# EAGLE design RGBClock (EAGLE 6.5.0)
AUTHOR_NAME: Matthias Beckert
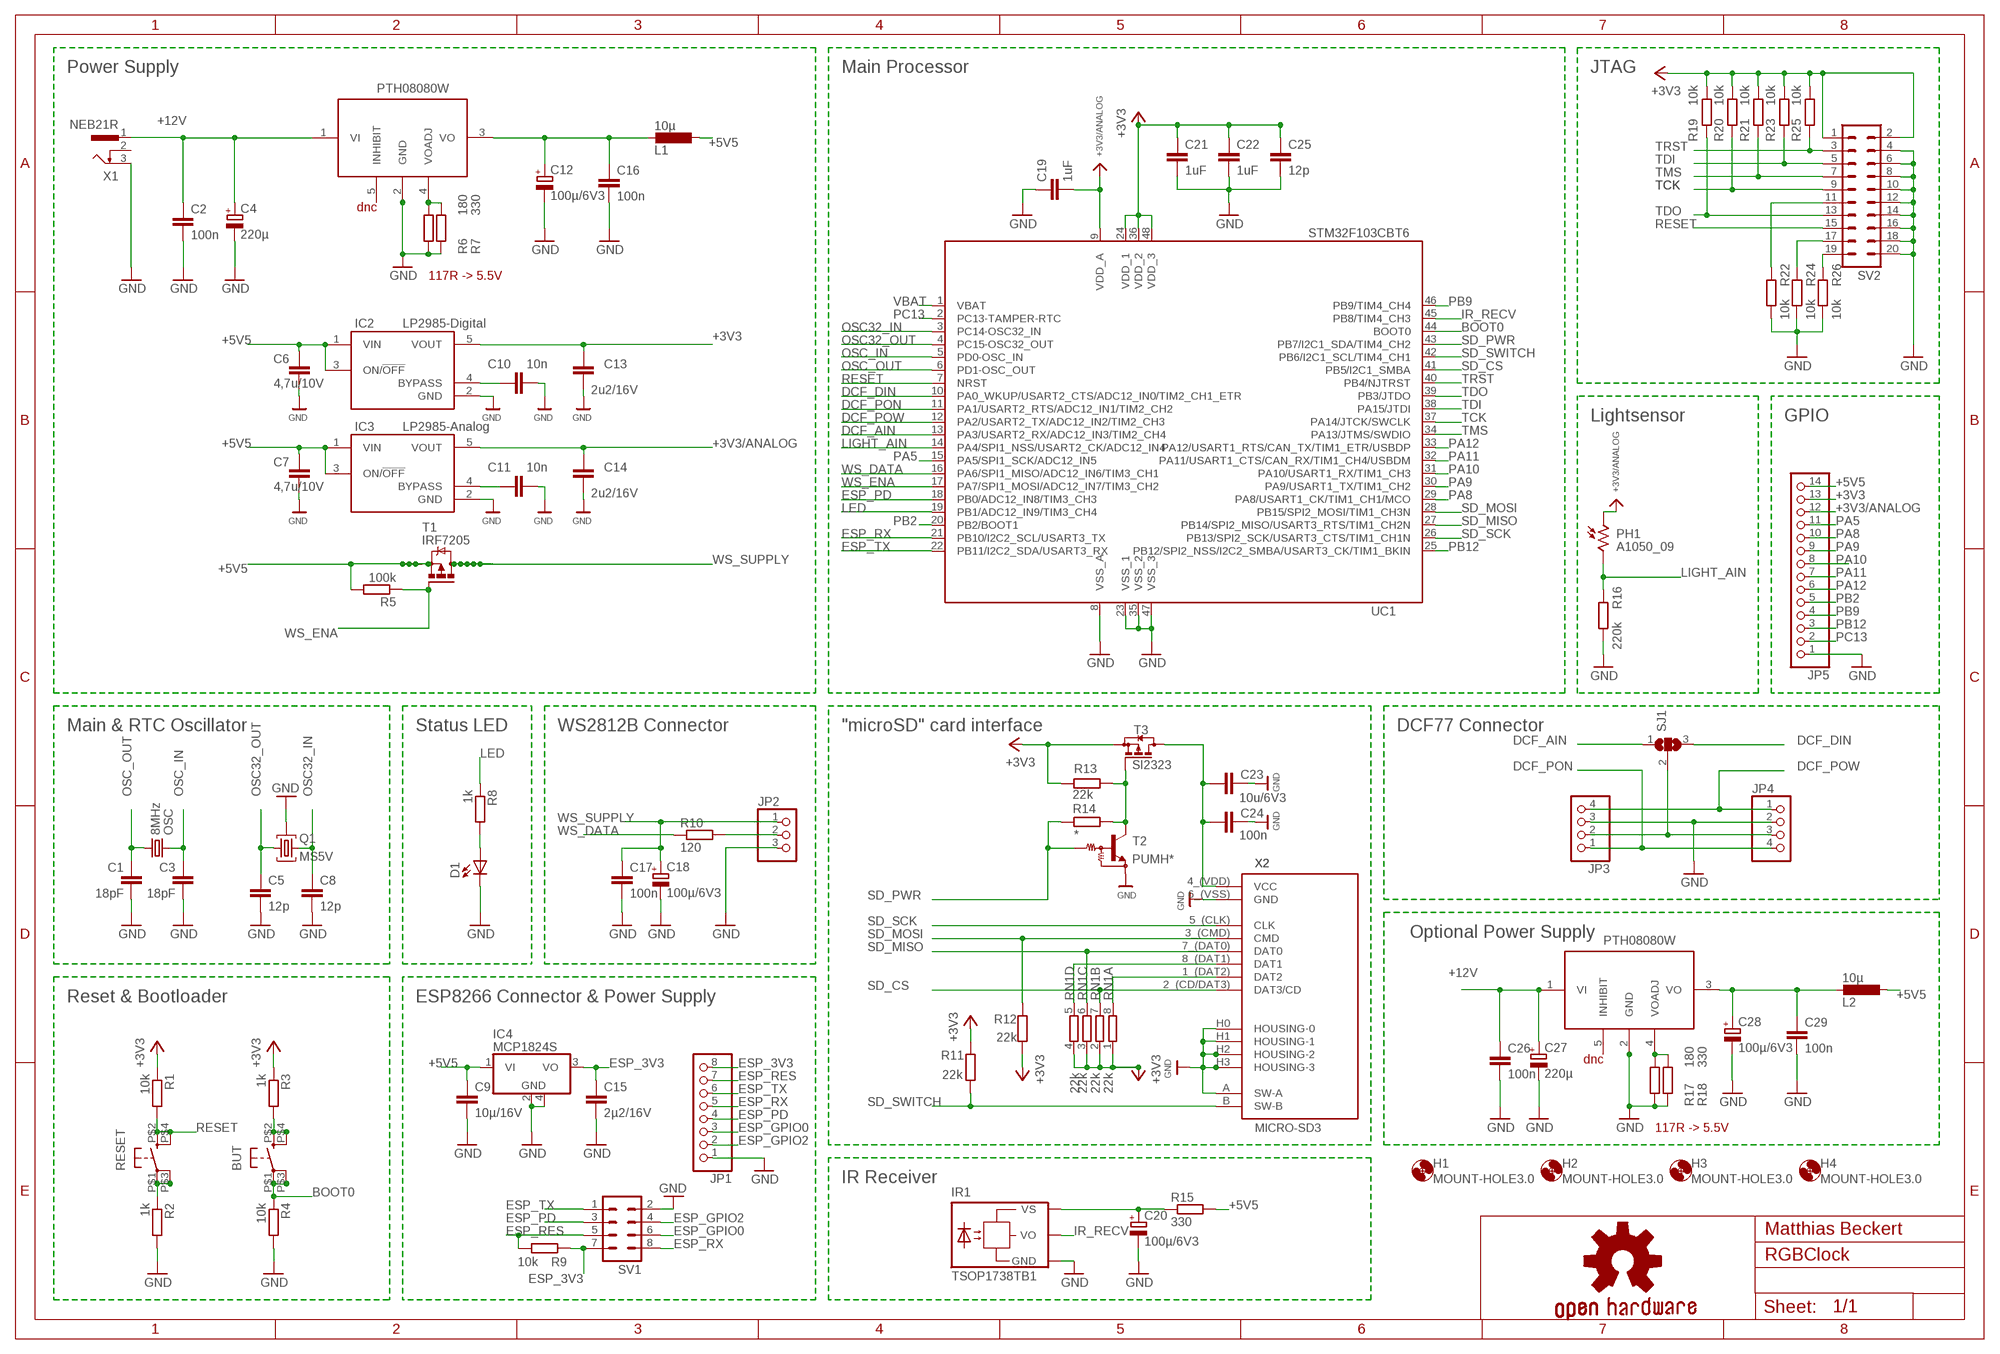
[diagram p0: schematic, sheet 1]

## Parts
BUT  KMR211GLFS  BUTTON-KMR241GLFS  [PUSHBUTTON-KMR241GLFS]
C1  18pF  CAP0402  [C0402]
C2  100n  C-EUC0603  [C0603]
C3  18pF  CAP0402  [C0402]
C4  220µ  CPOL-EUE3.5-8  [E3,5-8]
C5  12p  C-EUC0603  [C0603]
C6  4,7u/10V  C0603-DASHES  [C0603-DASHES]
C7  4,7u/10V  C0603-DASHES  [C0603-DASHES]
C8  12p  C-EUC0603  [C0603]
C9  10µ/16V  C-EUC0805  [C0805]
C10  10n  C0603-DASHES  [C0603-DASHES]
C11  10n  C0603-DASHES  [C0603-DASHES]
C12  100µ/6V3  CPOL-EUC  [PANASONIC_C]
C13  2u2/16V  C0603-DASHES  [C0603-DASHES]
C14  2u2/16V  C0603-DASHES  [C0603-DASHES]
C15  2µ2/16V  C-EUC0603  [C0603]
C16  100n  C-EUC0603  [C0603]
C17  100n  C-EUC0603  [C0603]
C18  100µ/6V3  CPOL-EUC  [PANASONIC_C]
C19  1uF  C-EUC0603  [C0603]
C20  100µ/6V3  CPOL-EUC  [PANASONIC_C]
C21  1uF  C-EUC0603  [C0603]
C22  1uF  C-EUC0603  [C0603]
C23  10u/6V3  C0603-DASHES  [C0603-DASHES]
C24  100n  C0603-DASHES  [C0603-DASHES]
C25  12p  C-EUC0603  [C0603]
C26  100n  C-EUC0603  [C0603]
C27  220µ  CPOL-EUE3.5-8  [E3,5-8]
C28  100µ/6V3  CPOL-EUC  [PANASONIC_C]
C29  100n  C-EUC0603  [C0603]
D1  Blue  LED1206  [LED-1206]
GOLD_ORB_SM1  OSHWLOGO_GOLD_ORB_MED  [OSHW1]
H1  MOUNT-HOLE3.0  [3,0]
H2  MOUNT-HOLE3.0  [3,0]
H3  MOUNT-HOLE3.0  [3,0]
H4  MOUNT-HOLE3.0  [3,0]
IC1  PTH08080W  [PTH08080W]
IC2  LP2985-Digital  LP2985  [SOT23-5]
IC3  LP2985-Analog  LP2985  [SOT23-5]
IC4  MCP1824S  [SOT223]
IC5  PTH08080W  [PTH08080W]
IR1  TSOP1738TB1  [TSOP17_TB1]
JP1  PINHD-1X8/90  [1X08/90]
JP2  PINHD-1X3/90  [1X03/90]
JP3  PINHD-1X4  [1X04]
JP4  PINHD-1X4  [1X04]
JP5  PINHD-1X14/90  [1X14/90]
L1  10µ  L-EU-PWRSD53  [SD53-XXX-R]
L2  10µ  L-EU-PWRSD53  [SD53-XXX-R]
OSC  8MHz  CRYSTAL5X3  [CRYSTAL-SMD-5X3]
PH1  A1050_09  [T0-46-A10XX]
Q1  MS5V  [MS5V]
R1  10k  R-EU_R0603  [R0603]
R2  1k  R-EU_R0603  [R0603]
R3  1k  R-EU_R0603  [R0603]
R4  10k  R-EU_R0603  [R0603]
R5  100k  R-EU_R0603  [R0603]
R6  180  R-EU_R0603  [R0603]
R7  330  R-EU_R0603  [R0603]
R8  1k  R-EU_R0603  [R0603]
R9  10k  R-EU_R0603  [R0603]
R10  120  R-EU_R0603  [R0603]
R11  22k  R0603-DASHES  [R0603-DASHES]
R12  22k  R0603-DASHES  [R0603-DASHES]
R13  22k  R0603-DASHES  [R0603-DASHES]
R14  *  R0603-DASHES  [R0603-DASHES]
R15  330  R-EU_R0603  [R0603]
R16  220k  R-EU_R0603  [R0603]
R17  180  R-EU_R0603  [R0603]
R18  330  R-EU_R0603  [R0603]
R19  10k  R-EU_R0603  [R0603]
R20  10k  R-EU_R0603  [R0603]
R21  10k  R-EU_R0603  [R0603]
R22  10k  R-EU_R0603  [R0603]
R23  10k  R-EU_R0603  [R0603]
R24  10k  R-EU_R0603  [R0603]
R25  10k  R-EU_R0603  [R0603]
R26  10k  R-EU_R0603  [R0603]
RESET  KMR211GLFS  BUTTON-KMR241GLFS  [PUSHBUTTON-KMR241GLFS]
RN1  22k  E4RCRA3A4E  [CRA3A4E]
SJ1  SJ2W0603  [JUM0603]
SV1  MA04-2  [MA04-2]
SV2  ML20L  [ML20L]
T1  IRF7205  P-MOSFET-SO8  [SO-08]
T2  PUMH*  BCR-SERIES-  [SOT23]
T3  SI2323  [SOT23]
UC1  STM32F103CBT6  STM32F103CB  [LQFP48]
X1  NEB21R  [NEB21R]
X2  MICRO-SD3  [HIROSE_DM3AT]

## Nets
+3V3: C13.1 C21.1 C22.1 C25.1 IC2.5(VOUT) JP5.13 R1.1 R3.1 R11.2 R12.2 R13.2 R19.1 R20.1 R21.1 R23.1 R25.1 RN1.1 RN1.2 RN1.3 RN1.4 SV2.1 SV2.2 T3.2(S) UC1.24(VDD_1) UC1.36(VDD_2) UC1.48(VDD_3)
+3V3/ANALOG: C14.1 C19.2 IC3.5(VOUT) JP5.12 PH1.1 UC1.9(VDD_A)
+5V5: C6.1 C7.1 C9.1 IC2.1(VIN) IC2.3(ON/!OFF) IC3.1(VIN) IC3.3(ON/!OFF) IC4.1(VI) JP5.14 L1.1 L2.1 R5.2 R15.2 T1.1(S) T1.2(S) T1.3(S)
+6V_EXT: C12.+ C16.1 IC1.3(VO) L1.2
+6V_EXT1: C28.+ C29.1 IC5.3(VO) L2.2
+12V [+20V]: C2.1 C4.+ C26.1 C27.+ IC1.1(VI) IC5.1(VI) X1.1
BOOT0: BUT.P$1 BUT.P$3 R4.1 UC1.44(BOOT0)
DCF_AIN: SJ1.1 UC1.13(PA3/USART2_RX/ADC12_IN3/TIM2_CH4)
DCF_DIN: SJ1.3 UC1.10(PA0_WKUP/USART2_CTS/ADC12_IN0/TIM2_CH1_ETR)
DCF_PON: JP3.1 JP4.4 UC1.11(PA1/USART2_RTS/ADC12_IN1/TIM2_CH2)
DCF_POW: JP3.4 JP4.1 UC1.12(PA2/USART2_TX/ADC12_IN2/TIM2_CH3)
ESP_3V3: C15.1 IC4.3(VO) JP1.8 R9.2 SV1.7
ESP_GPIO0: JP1.3 SV1.6
ESP_GPIO2: JP1.2 SV1.4
ESP_PD: JP1.4 SV1.3 UC1.18(PB0/ADC12_IN8/TIM3_CH3)
ESP_RES: JP1.7 R9.1 SV1.5
ESP_RX: JP1.5 SV1.8 UC1.21(PB10/I2C2_SCL/USART3_TX)
ESP_TX: JP1.6 SV1.1 UC1.22(PB11/I2C2_SDA/USART3_RX)
GND: C1.2 C2.2 C3.2 C4.- C5.2 C6.2 C7.2 C8.2 C9.2 C10.2 C11.2 C12.- C13.2 C14.2 C15.2 C16.2 C17.2 C18.- C19.1 C20.- C21.2 C22.2 C23.2 C24.2 C25.2 C26.2 C27.- C28.- C29.2 D1.C IC1.2(GND) IC2.2(GND) IC3.2(GND) IC4.2(GND) IC4.4(GND) IC5.2(GND) IR1.GND JP1.1 JP2.3 JP3.3 JP4.2 JP5.1 Q1.H R2.2 R4.2 R6.2 R7.2 R16.1 R17.2 R18.2 R22.1 R24.1 R26.1 SV1.2 SV2.4 SV2.6 SV2.8 SV2.10 SV2.12 SV2.14 SV2.16 SV2.18 SV2.20 T2.2(E) UC1.8(VSS_A) UC1.23(VSS_1) UC1.35(VSS_2) UC1.47(VSS_3) X1.3 X2.6_(VSS)(GND) X2.A(SW-A) X2.H0(HOUSING-0) X2.H1(HOUSING-1) X2.H2(HOUSING-2) X2.H3(HOUSING-3)
IR_RECV: IR1.VO UC1.45(PB8/TIM4_CH3)
LED: R8.1 UC1.19(PB1/ADC12_IN9/TIM3_CH4)
LIGHT_AIN: PH1.2 R16.2 UC1.14(PA4/SPI1_NSS/USART2_CK/ADC12_IN4)
LP2985_BYPASS: C11.1 IC3.4(BYPASS)
LP2985_BYPASS1: C10.1 IC2.4(BYPASS)
N$1: BUT.P$2 BUT.P$4 R3.2
N$2: D1.A R8.2
N$3: JP2.2 R10.2
N$4: R2.1 RESET.P$1 RESET.P$3
N$5: IC5.4(VOADJ) R17.1 R18.1
N$6: R26.2 SV2.19
N$7: JP3.2 JP4.3 SJ1.2
N$8: R24.2 SV2.17
N$9: R22.2 SV2.11
N$10: C20.+ IR1.VS R15.1
N$11: RN1.8 X2.1_(DAT2)(DAT2)
N$14: RN1.5 X2.8_(DAT1)(DAT1)
N$56: IC1.4(VOADJ) R6.1 R7.1
OSC32_IN: C8.1 Q1.2 UC1.3(PC14-OSC32_IN)
OSC32_OUT: C5.1 Q1.1 UC1.4(PC15-OSC32_OUT)
OSC_IN: C3.1 OSC.3 UC1.5(PD0-OSC_IN)
OSC_OUT: C1.1 OSC.1 UC1.6(PD1-OSC_OUT)
PA5: JP5.11 UC1.15(PA5/SPI1_SCK/ADC12_IN5)
PA8: JP5.10 UC1.29(PA8/USART1_CK/TIM1_CH1/MCO)
PA9: JP5.9 UC1.30(PA9/USART1_TX/TIM1_CH2)
PA10: JP5.8 UC1.31(PA10/USART1_RX/TIM1_CH3)
PA11: JP5.7 UC1.32(PA11/USART1_CTS/CAN_RX/TIM1_CH4/USBDM)
PA12: JP5.6 UC1.33(PA12/USART1_RTS/CAN_TX/TIM1_ETR/USBDP)
PB2: JP5.5 UC1.20(PB2/BOOT1)
PB9: JP5.4 UC1.46(PB9/TIM4_CH4)
PB12: JP5.3 UC1.25(PB12/SPI2_NSS/I2C2_SMBA/USART3_CK/TIM1_BKIN)
PC13: JP5.2 UC1.2(PC13-TAMPER-RTC)
RESET: R1.2 RESET.P$2 RESET.P$4 SV2.15 UC1.7(NRST)
SD_CS: RN1.7 UC1.41(PB5/I2C1_SMBA) X2.2_(CD/DAT3)(DAT3/CD)
SD_MISO: RN1.6 UC1.27(PB14/SPI2_MISO/USART3_RTS/TIM1_CH2N) X2.7_(DAT0)(DAT0)
SD_MOSI: R12.1 UC1.28(PB15/SPI2_MOSI/TIM1_CH3N) X2.3_(CMD)(CMD)
SD_PWR: R14.2 T2.1(B) UC1.43(PB7/I2C1_SDA/TIM4_CH2)
SD_PWR_INV: R13.1 R14.1 T2.3(C) T3.1(G)
SD_SCK: UC1.26(PB13/SPI2_SCK/USART3_CTS/TIM1_CH1N) X2.5_(CLK)(CLK)
SD_SWITCH: R11.1 UC1.42(PB6/I2C1_SCL/TIM4_CH1) X2.B(SW-B)
SDIO_VCC: C23.1 C24.1 T3.3(D) X2.4_(VDD)(VCC)
TCK: R20.2 SV2.9 UC1.37(PA14/JTCK/SWCLK)
TDI: R23.2 SV2.5 UC1.38(PA15/JTDI)
TDO: R19.2 SV2.13 UC1.39(PB3/JTDO)
TMS: R21.2 SV2.7 UC1.34(PA13/JTMS/SWDIO)
TRST: R25.2 SV2.3 UC1.40(PB4/NJTRST)
VBAT: UC1.1(VBAT)
WS_DATA: R10.1 UC1.16(PA6/SPI1_MISO/ADC12_IN6/TIM3_CH1)
WS_ENA: R5.1 T1.4(G) UC1.17(PA7/SPI1_MOSI/ADC12_IN7/TIM3_CH2)
WS_SUPPLY [+20V]: C17.1 C18.+ JP2.1 T1.5(D) T1.6(D) T1.7(D) T1.8(D)
Unconnected: IC1.5(INHIBIT) IC5.5(INHIBIT) X1.2

## Notes on the sheet
- Power Supply | Main Processor | JTAG
- PTH08080W
- dnc
- 117R -> 5.5V
- Lightsensor | GPIO
- Main & RTC Oscillator | Status LED | WS2812B Connector | "microSD" card interface | DCF77 Connector
- Optional Power Supply
- PTH08080W
- Reset & Bootloader | ESP8266 Connector & Power Supply
- dnc
- 117R -> 5.5V
- IR Receiver

## Library data of the parts
BUT RESET = okie:BUTTON-KMR241GLFS
C1 C3 = SparkFun:CAP: Capacitor Standard 0603 ceramic capacitor, and 0.1" leaded capacitor.
C2 C5 C8 C9 C15-C17 C19 C21 C22 C25 C26 C29 = rcl:C-EU: CAPACITOR, European symbol
C4 C12 C18 C20 C27 C28 = rcl:CPOL-EU: POLARIZED CAPACITOR, European symbol
C6 C7 C10 C11 C13 C14 C23 C24 = 00ralf:C0603-DASHES
D1 = SparkFun:LED: LEDs Standard schematic elements and footprints for 5mm, 3mm, 1206, and 0603 sized LEDs. 5mm - Spark Fun Electronics SKU : COM-00529 (and others)
GOLD_ORB_SM1 = bfl:OSHWLOGO: These are Open-Source Hardware logos.
H1-H4 = holes:MOUNT-HOLE: MOUNTING HOLE with drill center marker
IC1 IC5 = mibu:PTH08080W
IC2 IC3 = v-reg:LP2985
IC4 = linear:MCP1824S
IR1 = IR:TSOP17*TB1: TSOP17..TB1 IR Receiver Modules for Remote Control Systems Source: http://www.vishay.com/docs/82042/82042.pdf; OC_FARNELL: unknown; OC_NEWARK: unknown
JP1 = pinhead:PINHD-1X8: PIN HEADER
JP2 = pinhead:PINHD-1X3: PIN HEADER
JP3 JP4 = pinhead:PINHD-1X4: PIN HEADER
JP5 = pinhead:PINHD-1X14: PIN HEADER
L1 L2 = rcl:L-EU-PWR; DIGIKEY-PN: 513-1457-1-ND
OSC = SparkFun2:CRYSTAL: Crystals Various standard crystals. Proven footprints. Spark Fun Electronics SKU : COM-00534
PH1 = photo-elements:A10: Sensor Robust Light Sensing Applications Outdoor Light Sensing Application Source: http://optoelectronics.perkinelmer.com/content/Datasheets/DTS_PhotocellsA1050.pdf
Q1 = crystal:MS5V
R1-R10 R15-R26 = rcl:R-EU_: RESISTOR, European symbol
R11-R14 = 00ralf:R0603-DASHES
RN1 = resistor-sil:E4R: SIL RESISTOR; PART_TYPE: EXB-N8V
SJ1 = jumper:SJ2W: SMD solder JUMPER
SV1 = con-lstb:MA04-2: PIN HEADER; OC_FARNELL: unknown; OC_NEWARK: unknown
SV2 = con-harting-ml:ML20: HARTING; OC_FARNELL: unknown; OC_NEWARK: unknown
T1 = transistor-power:P-MOSFET-SO8: P-Channel MOSFET Example: FDS4435A; P-Channel Logic Level PowerTrench® MOSFET FDS4465; P-Channel 1.8V Specified PowerTrench® MOSFET Source: www.fairchildsemi.com
T2 = transistor-digital:BCR-SERIES
T3 = transistor-fet:SI2323: P-CHANNEL MOS FET
UC1 = stm32:STM32F103CB
X1 = con-lumberg:NEB21R: Netzgeräte-Einbaukupplung abgewinkelte Ausführung mit Öffner Source: http://www.lumberg.com/Produkte/PDFs/NEB21R.pdf; MPN: NEB 21 R; OC_FARNELL: 1217037; OC_NEWARK: 97K6458
X2 = con-cards:MICRO-SD

## Net classes
4 +20V: clearance 0.2 mm

## Board
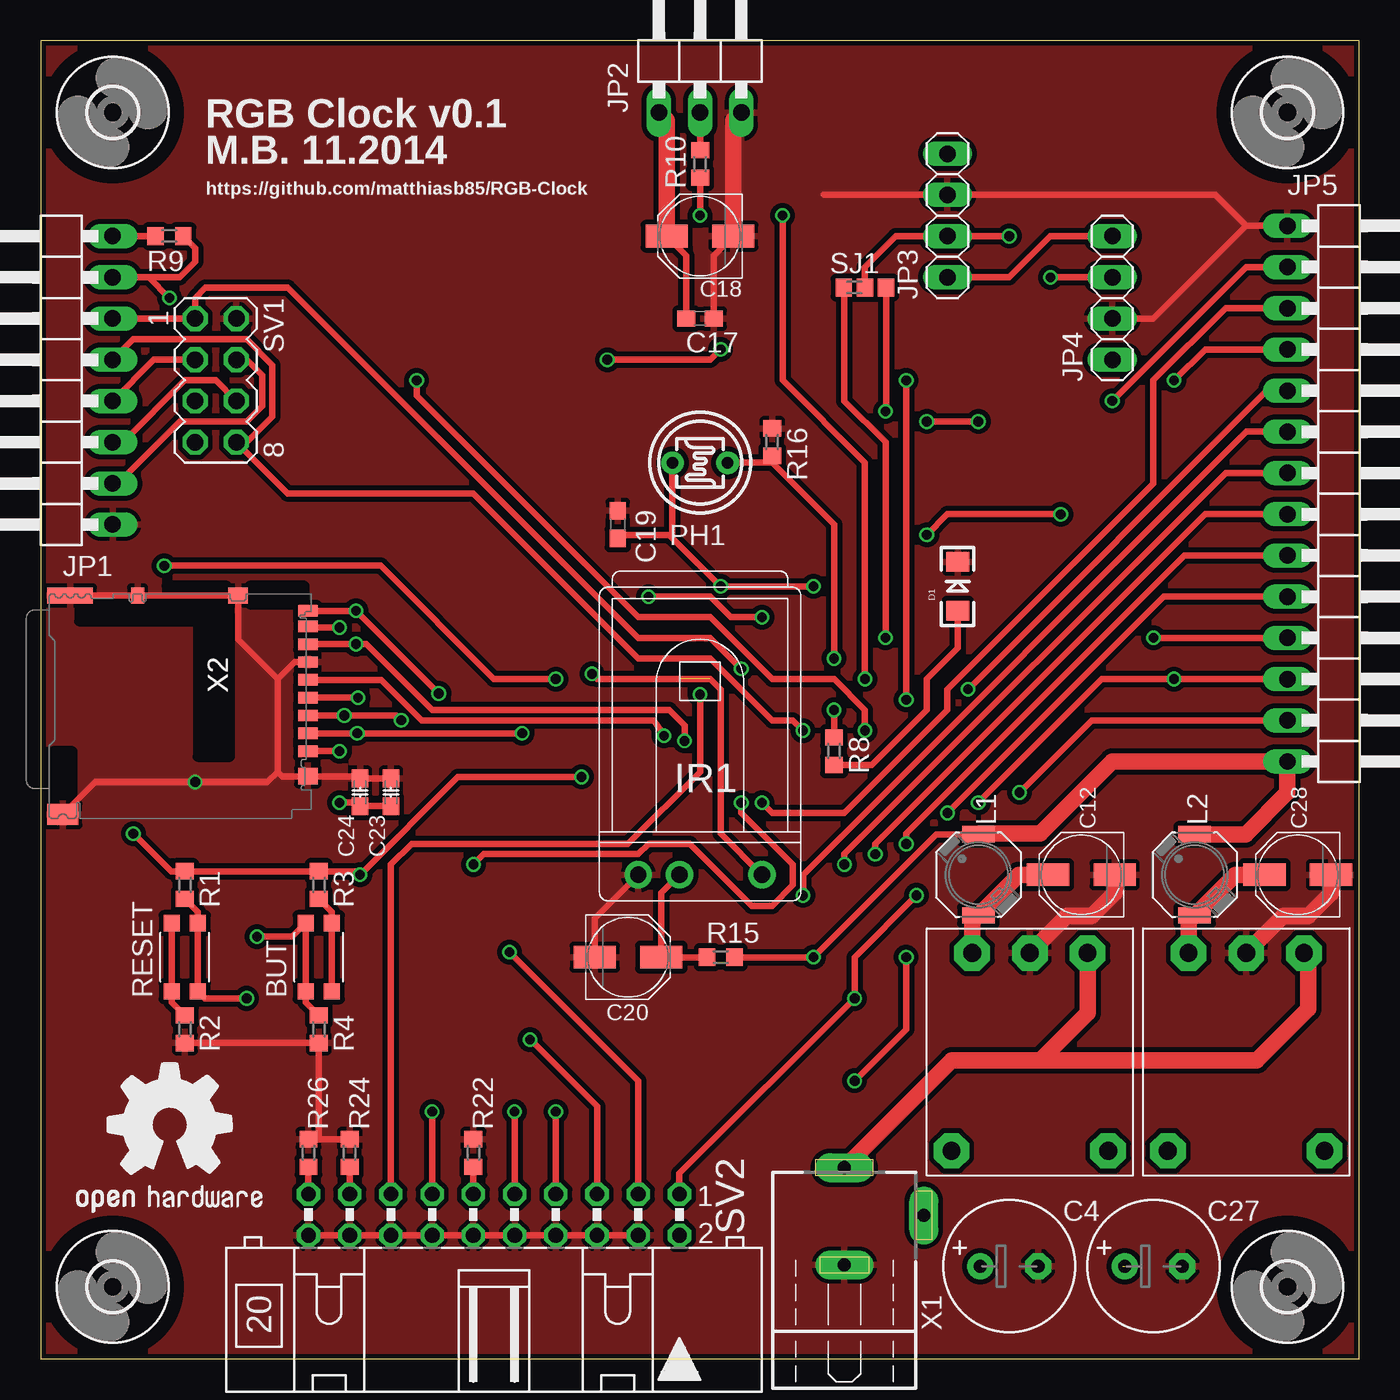
[diagram p1: board, top side]
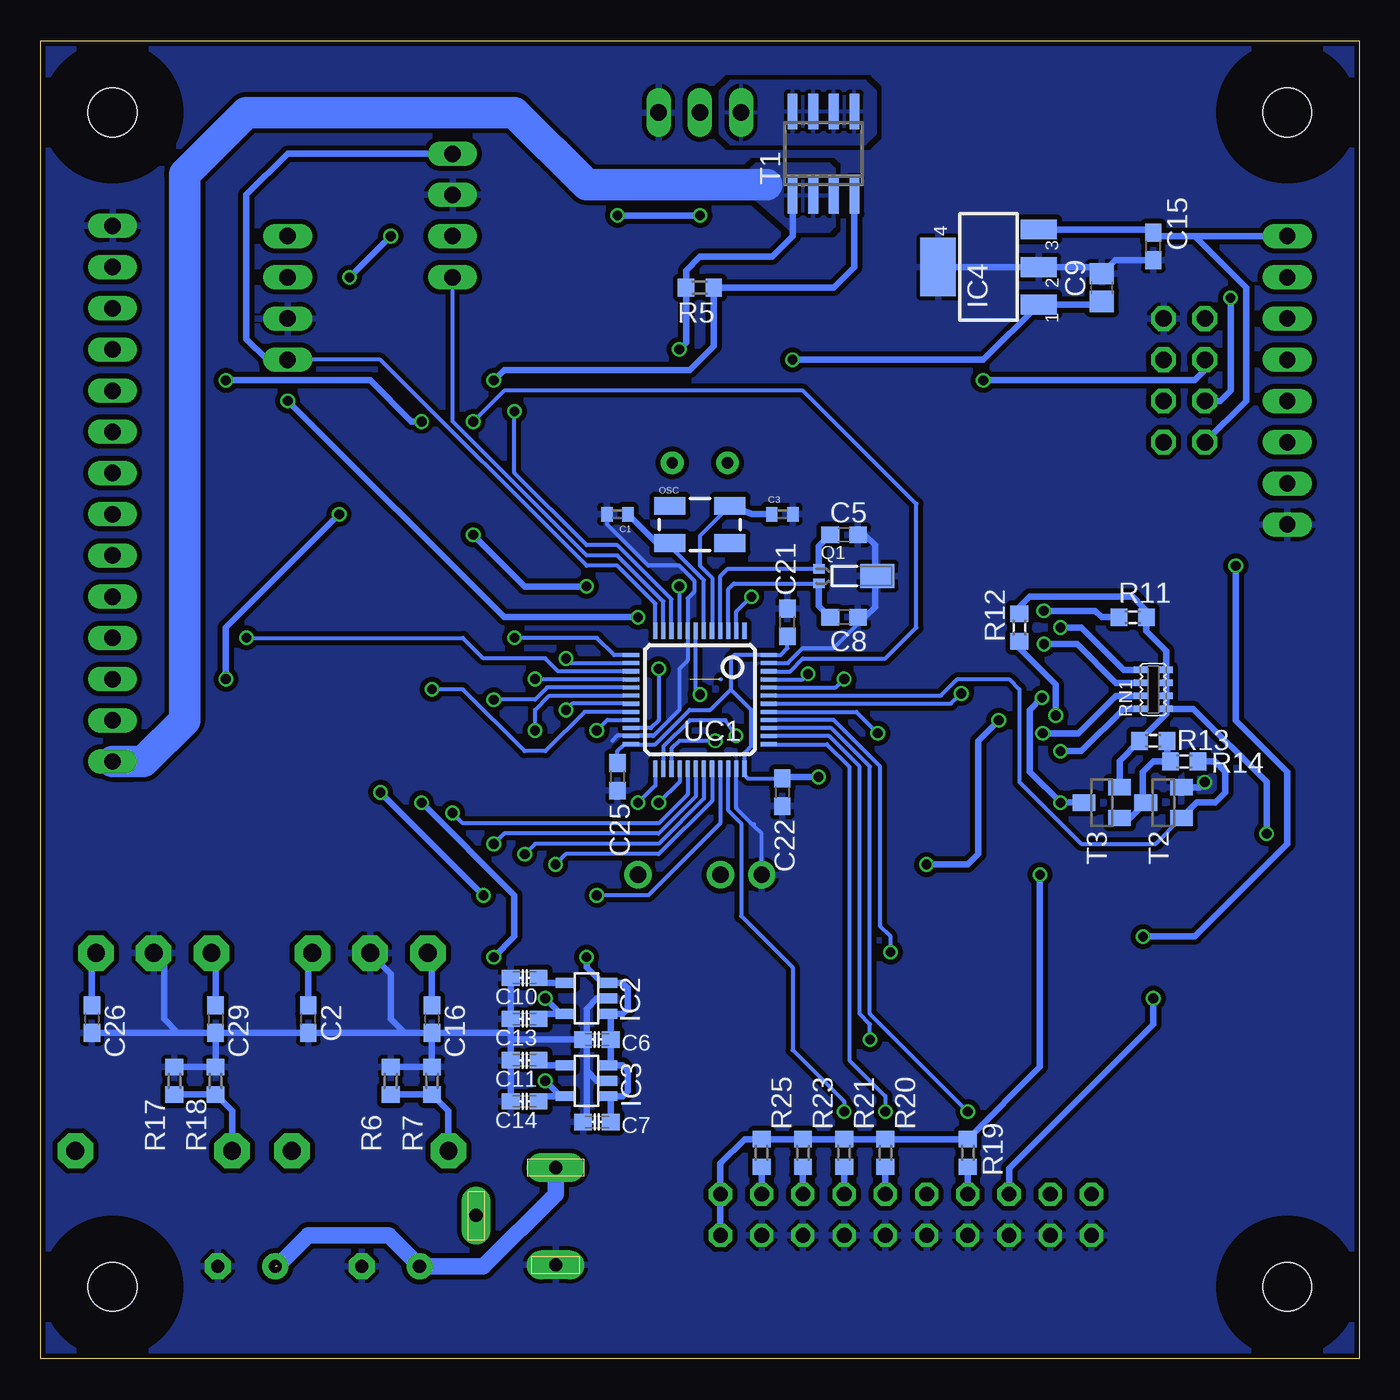
[diagram p2: board, bottom side, seen from below]

Size 81.27 x 81.27 mm. Coordinates in mm from the lower left corner, seen from the top.
Outline: 0,0 81.27,0 81.27,81.27 0,81.27 0,0
Copper layers (1*16): Top 0.035mm / dielectric 1.5mm / Bottom 0.035mm
Design rules "dirt_cheap_dirty_boards.v1": minimum track width 5mil, minimum drill 12mil, track to track 5mil, track to pad 5mil, pad to pad 5mil, via to via 5mil, smd to smd 0mil, copper to edge 10mil, drill to drill 10mil, minimum pad ring 10mil, minimum via ring 6mil, stop-mask expansion 2mil, vias tented up to drill 25mil, thermal gap 10mil

### Footprints (pad centres in the part's own frame; a part is rotated, then mirrored left to right if it is on the bottom)
PUSHBUTTON-KMR241GLFS = smd 1 x 1: P$1 2.1,0.8; P$2 2.1,-0.8; P$3 -2.1,0.8; P$4 -2.1,-0.8
C0402 = smd 0.7 x 0.9: 1 -0.65,0; 2 0.65,0
C0603 = smd 1.1 x 1: 1 -0.85,0; 2 0.85,0
E3,5-8 = drill 0.813 pad 1.6: + -1.778,0 | drill 0.813 pad 1.6 octagon: - 1.778,0
C0603-DASHES = smd 1.1 x 1: 1 -0.85,0; 2 0.85,0
C0805 = smd 1.3 x 1.5: 1 -0.85,0; 2 0.85,0
PANASONIC_C = smd 2.6 x 1.4: + 2.05,0; - -2.05,0
LED-1206 = smd 1.2 x 1.4: A -1.5,0; C 1.5,0
3,0 = hole 3: 0,0
PTH08080W = drill 1.1 pad 2.184 octagon: 1 -6.604,3.556; 2 -6.604,0; 3 -6.604,-3.556; 4 5.588,-4.826; 5 5.588,4.826
SOT23-5 = smd 0.6 x 1.2: 1 -0.95,-1.306; 2 0,-1.306; 3 0.95,-1.306; 4 0.95,1.306; 5 -0.95,1.306
SOT223 = smd 1.219 x 2.235: 1 -2.311,-3.099; 2 0,-3.099; 3 2.311,-3.099 | smd 3.6 x 2.2: 4 0,3.099
TSOP17_TB1 = drill 1 pad 1.676: GND 0,-3.81; VO 0,3.81; VS 0,-1.27
1X08/90 = drill 1.016 long: 1 -8.89,-3.81; 2 -6.35,-3.81; 3 -3.81,-3.81; 4 -1.27,-3.81; 5 1.27,-3.81; 6 3.81,-3.81; 7 6.35,-3.81; 8 8.89,-3.81
1X03/90 = drill 1.016 long: 1 -2.54,-3.81; 2 0,-3.81; 3 2.54,-3.81
1X04 = drill 1.016 long: 1 -3.81,0; 2 -1.27,0; 3 1.27,0; 4 3.81,0
1X14/90 = drill 1.016 long: 1 -16.51,-3.81; 2 -13.97,-3.81; 3 -11.43,-3.81; 4 -8.89,-3.81; 5 -6.35,-3.81; 6 -3.81,-3.81; 7 -1.27,-3.81; 8 1.27,-3.81; 9 3.81,-3.81; 10 6.35,-3.81; 11 8.89,-3.81; 12 11.43,-3.81; 13 13.97,-3.81; 14 16.51,-3.81
SD53-XXX-R = smd 1 x 2: 1 -2.5,0; 2 2.5,0
CRYSTAL-SMD-5X3 = smd 1.9 x 1.1: 1 -1.85,-1.15; 2 1.85,-1.15; 3 1.85,1.15; 4 -1.85,1.15
T0-46-A10XX = drill 0.7 pad 1.4: 1 -1.7,0; 2 1.7,0
MS5V = smd 0.7 x 0.6: 1 0.35,0.45; 2 0.35,-0.45 | smd 2.1 x 1.5: H 3.95,0
R0603 = smd 1 x 1.1: 1 -0.85,0; 2 0.85,0
R0603-DASHES = smd 1 x 1.1: 1 -0.85,0; 2 0.85,0
CRA3A4E = smd 0.4 x 0.8: 1 -1.2,-0.8; 2 -0.4,-0.8; 3 0.4,-0.8; 4 1.2,-0.8; 5 1.2,0.8; 6 0.4,0.8; 7 -0.4,0.8; 8 -1.2,0.8
JUM0603 = smd 1 x 1.1: 1 -1.3,0; 2 0,0; 3 1.3,0
MA04-2 = drill 1.016 octagon: 1 -3.81,-1.27; 2 -3.81,1.27; 3 -1.27,-1.27; 4 -1.27,1.27; 5 1.27,-1.27; 6 1.27,1.27; 7 3.81,-1.27; 8 3.81,1.27
ML20L = drill 0.914 octagon: 1 -11.43,-1.27; 2 -11.43,1.27; 3 -8.89,-1.27; 4 -8.89,1.27; 5 -6.35,-1.27; 6 -6.35,1.27; 7 -3.81,-1.27; 8 -3.81,1.27; 9 -1.27,-1.27; 10 -1.27,1.27; 11 1.27,-1.27; 12 1.27,1.27; 13 3.81,-1.27; 14 3.81,1.27; 15 6.35,-1.27; 16 6.35,1.27; 17 8.89,-1.27; 18 8.89,1.27; 19 11.43,-1.27; 20 11.43,1.27
SO-08 = smd 0.6 x 2.2: 1 -1.905,-2.6; 2 -0.635,-2.6; 3 0.635,-2.6; 4 1.905,-2.6; 5 1.905,2.6; 6 0.635,2.6; 7 -0.635,2.6; 8 -1.905,2.6
SOT23 = smd 1 x 1.4: 1 -0.95,-1.1; 2 0.95,-1.1; 3 0,1.1
LQFP48 = smd 0.254 x 1: 1 -2.75,-4.25; 2 -2.25,-4.25; 3 -1.75,-4.25; 4 -1.25,-4.25; 5 -0.75,-4.25; 6 -0.25,-4.25; 7 0.25,-4.25; 8 0.75,-4.25; 9 1.25,-4.25; 10 1.75,-4.25; 11 2.25,-4.25; 12 2.75,-4.25; 25 2.75,4.25; 26 2.25,4.25; 27 1.75,4.25; 28 1.25,4.25; 29 0.75,4.25; 30 0.25,4.25; 31 -0.25,4.25; 32 -0.75,4.25; 33 -1.25,4.25; 34 -1.75,4.25; 35 -2.25,4.25; 36 -2.75,4.25 | smd 1 x 0.254: 13 4.25,-2.75; 14 4.25,-2.25; 15 4.25,-1.75; 16 4.25,-1.25; 17 4.25,-0.75; 18 4.25,-0.25; 19 4.25,0.25; 20 4.25,0.75; 21 4.25,1.25; 22 4.25,1.75; 23 4.25,2.25; 24 4.25,2.75; 37 -4.25,2.75; 38 -4.25,2.25; 39 -4.25,1.75; 40 -4.25,1.25; 41 -4.25,0.75; 42 -4.25,0.25; 43 -4.25,-0.25; 44 -4.25,-0.75; 45 -4.25,-1.25; 46 -4.25,-1.75; 47 -4.25,-2.25; 48 -4.25,-2.75
NEB21R = drill 0.813 pad 1.778 long: 1 0,7.35; 2 4.9,4.4; 3 0,1.35
HIROSE_DM3AT = smd 0.7 x 1.2: 1_(DAT2) 0,0.6; 2_(CD/DAT3) -1.1,0.6; 3_(CMD) -2.2,0.6; 4_(VDD) -3.3,0.6; 5_(CLK) -4.4,0.6; 6_(VSS) -5.5,0.6; 7_(DAT0) -6.6,0.6; 8_(DAT1) -7.7,0.6; B -8.65,0.6 | smd 1 x 0.8: A -9.6,-9.9 | smd 1 x 2.8: H0 -9.6,-14.05 | smd 1 x 1.2: H1 -9.6,-3.7; H2 1.55,0.6 | smd 1.3 x 1.9: H3 3.9,-14.5

### Placement (x,y rotation side)
BUT  17.14,24.77 90 top
C1  45.72,52.07 180 bottom
C2  64.77,20.95 270 bottom
C3  35.56,52.07 0 bottom
C4  59.69,5.71 0 top
C5  31.75,50.8 0 bottom
C6  46.99,19.68 180 bottom
C7  46.99,14.61 180 bottom
C8  31.75,45.72 0 bottom
C9  15.88,66.04 90 bottom
C10  51.44,23.5 180 bottom
C11  51.44,18.41 180 bottom
C12  64.14,29.84 180 top
C13  51.44,20.95 180 bottom
C14  51.44,15.88 180 bottom
C15  12.7,68.58 270 bottom
C16  57.15,20.95 270 bottom
C17  40.64,64.14 0 top
C18  40.64,69.22 180 top
C19  35.56,51.44 270 top
C20  36.2,24.77 0 top
C21  35.24,45.4 90 bottom
C22  35.56,34.92 270 bottom
C23  21.59,34.92 90 top
C24  19.68,34.92 90 top
C25  45.72,35.88 270 bottom
C26  78.11,20.95 270 bottom
C27  68.58,5.71 0 top
C28  77.47,29.84 180 top
C29  70.48,20.95 270 bottom
D1  56.52,47.62 90 top
GOLD_ORB_SM1  1.59,7.3 0 top
H1  76.83,4.45 0 top
H2  4.45,4.45 0 top
H3  4.45,76.83 0 top
H4  76.83,76.83 0 top
IC1  60.96,18.41 270 top
IC2  47.62,22.23 90 bottom
IC3  47.62,17.14 90 bottom
IC4  22.86,67.31 90 bottom
IC5  74.3,18.41 270 top
IR1  40.64,29.84 270 top
JP1  0.64,60.33 90 top
JP2  40.64,80.64 0 top
JP3  55.88,70.48 90 top
JP4  66.04,65.41 90 top
JP5  80.64,53.34 270 top
L1  57.78,29.84 270 top
L2  71.12,29.84 270 top
OSC  40.64,51.44 0 bottom
PH1  40.64,55.24 0 top
Q1  33.66,48.26 0 bottom
R1  8.89,29.21 270 top
R2  8.89,20.32 270 top
R3  17.14,29.21 270 top
R4  17.14,20.32 270 top
R5  40.64,66.04 180 bottom
R6  59.69,17.14 90 bottom
R7  57.15,17.14 90 bottom
R8  48.9,37.47 270 top
R9  7.94,69.22 180 top
R10  40.64,73.66 90 top
R11  13.97,45.72 0 bottom
R12  20.95,45.09 90 bottom
R13  12.7,38.1 180 bottom
R14  10.79,36.83 0 bottom
R15  41.91,24.77 0 top
R16  45.09,56.52 270 top
R17  73.03,17.14 90 bottom
R18  70.48,17.14 90 bottom
R19  24.13,12.7 270 bottom
R20  29.21,12.7 270 bottom
R21  31.75,12.7 270 bottom
R22  26.67,12.7 270 top
R23  34.29,12.7 270 bottom
R24  19.05,12.7 270 top
R25  36.83,12.7 270 bottom
R26  16.51,12.7 270 top
RESET  8.89,24.77 90 top
RN1  12.7,41.27 90 bottom
SJ1  50.8,66.04 0 top
SV1  10.79,60.33 270 top
SV2  27.94,8.89 180 top
T1  33.02,74.3 0 bottom
T2  12.06,34.29 90 bottom
T3  15.88,34.29 90 bottom
UC1  40.64,40.64 180 bottom
X1  49.53,4.45 0 top
X2  15.88,37.47 270 top

### Tracks (layer width: path | path; a pad name or v marks a point on that pad's centre or on a via)
+3V3  (via drill 0.6)
  Top 0.406: R1.1 R3.1 | R3.1 17.14,29.84 | R3.1 8.04,30.06 v5.71,32.38 | R3.1 19.47,30.06 v19.68,29.84 25.72,35.88 v33.34,35.88 | v53.98,28.57 50.16,24.77 v50.16,22.23 39.37,11.43 SV2.1 | JP5.13 64.77,39.37 v60.33,34.92
  Bottom 0.254: 38.73,41.27 40.01,40.01 41.27,40.01 43.39,37.89 UC1.24 45.3,37.89 45.72,37.47 C25.1 | 38.73,41.27 38.73,43.18 38.52,43.39 UC1.48 35.67,43.39 35.24,43.81 C21.1 | 38.73,41.27 37.47,40.01 37.47,37.78 37.89,37.36 UC1.36 37.89,35.98 37.68,35.77 C22.1
  Bottom 0.406: RN1.1 RN1.2 RN1.3 | RN1.3 RN1.4 11.9,43.65 13.12,44.87 R11.2 arc-53 13.34,46.35 13.97,46.99 20.32,46.99 20.95,46.35 R12.2 | RN1.1 11.85,40.02 | T3.2 14.78,36.88 R13.2 11.9,39.75 RN1.1 | SV2.2 SV2.1 39.37,12.06 37.88,13.55 R25.1 R23.1 R21.1 R20.1 R19.1 19.68,18 v19.68,29.84 | RN1.3 RN1.1 | v5.71,32.38 5.71,35.56 10.23,40.08 RN1.1 | C13.1 50.27,21.27 IC2.5 49.22,21.27 v50.16,22.23 | v53.98,28.57 v60.33,34.92 | C22.1 35.46,35.88 v33.34,35.88
+3V3/ANALOG  (via drill 0.6)
  Top 0.406: PH1.1 38.94,50.59 | 38.94,50.59 v41.91,47.62 v47.62,47.62 | C19.2 35.77,50.8 38.73,50.8 38.94,50.59 | v57.78,34.29 65.41,41.91 v69.85,41.91 JP5.12 | v62.87,52.07 55.88,52.07 v54.61,50.8 | v53.34,24.77 53.34,20.32 v50.16,17.14
  Bottom 0.254: v41.91,47.62 41.91,44.91 UC1.9
  Bottom 0.406: v69.85,41.91 69.85,45.09 v62.87,52.07 | v54.61,50.8 51.44,47.62 v47.62,47.62 | C14.1 50.59,16.2 IC3.5 49.22,16.2 v50.16,17.14 | v57.78,34.29 52.07,28.57 52.07,26.04 v53.34,24.77
+5V5  (via drill 0.6)
  Top 0.406: v34.92,61.59 41.27,61.59 v41.91,62.23 | L1.1 55.2,32.34 v47.62,24.77 R15.2
  Top 1.016: L1.1 57.83,32.38 61.59,32.38 66.04,36.83 JP5.14 76.83,34.92 74.25,32.34 L2.1
  Bottom 0.406: C9.1 16.07,65 IC4.1 23.16,61.59 v34.92,61.59 | v41.91,62.23 41.49,62.65 R5.2 41.49,67.09 40.64,67.94 36.2,67.94 34.92,69.22 T1.1 | v47.62,24.77 47.62,24.13 46.67,23.18 IC2.3 45.4,23.18 45.09,22.86 45.09,21.59 45.4,21.27 IC2.1 46.14,21.1 C6.1 46.14,18.27 IC3.3 45.4,18.09 45.09,17.78 45.09,16.51 45.4,16.2 IC3.1 46.14,16.02 C7.1
  Bottom 1.93: 75.56,36.83 JP5.14 74.93,36.83 72.39,39.37 72.39,73.03 68.58,76.83 52.07,76.83 47.62,72.39 36.51,72.39
  pour Bottom: 37.47,71.75 37.47,73.34 37.15,73.66 32.7,73.66 32.38,73.34 32.38,69.85 32.7,69.53 34.92,69.53
+6V_EXT
  Top 1.016: IC1.3 57.4,26.96 L1.2 60.28,29.84 C12.+
  Bottom 0.406: C16.1 57.15,24.77 IC1.3
+6V_EXT1
  Top 1.016: IC5.3 70.74,26.96 L2.2 73.62,29.84 C28.+
  Bottom 0.406: C29.1 70.48,24.77 IC5.3
+12V  (1 unrouted)
  Top 1.016: X1.1 56.15,18.41 61.59,18.41 | 61.59,18.41 64.52,21.34 IC1.1 | IC5.1 78.11,24.77 78.11,21.59 74.93,18.41 61.59,18.41
  Bottom 0.406: C26.1 78.11,24.77 IC5.1 | C2.1 64.77,24.77 IC1.1
  Bottom 1.016: X1.1 49.53,10.16 53.98,5.71 C4.+ 59.82,7.62 64.77,7.62 66.67,5.71
BOOT0  (via drill 0.6)
  Top 0.406: R4.1 16.34,21.97 BUT.P$3 BUT.P$1 15.52,26.04 v13.34,26.04 | v31.75,41.91 27.94,41.91 20.95,48.9 v7.62,48.9
  Bottom 0.254: UC1.44 32.27,41.39 v31.75,41.91
  Bottom 0.406: v7.62,48.9 7.62,39.37 4.45,36.2 4.45,31.75 10.16,26.04 v13.34,26.04
DCF_AIN  (via drill 0.6)
  Top 0.406: SJ1.1 49.53,66.01 49.53,59.05 52.07,56.52 v52.07,44.45
  Bottom 0.254: UC1.13 45.93,43.39 46.99,44.45 v52.07,44.45
DCF_DIN  (via drill 0.6)
  Top 0.406: SJ1.3 52.1,58.45 v52.07,58.42
  Bottom 0.254: UC1.10 42.39,46.84 45.72,50.16 47.62,50.16 52.07,54.61 v52.07,58.42
DCF_PON
  Top 0.406: JP4.4 62.23,69.22 59.69,66.67 JP3.1
  Bottom 0.254: UC1.11 42.89,46.7 45.72,49.53 47.62,49.53 55.88,57.78 JP3.1
DCF_POW
  Bottom 0.254: UC1.12 43.39,46.56 45.72,48.9 47.62,48.9 60.33,61.59 66.67,61.59
  Bottom 0.406: JP3.4 66.04,74.3 68.58,71.75 68.58,62.87 67.31,61.59 66.67,61.59 JP4.1
ESP_3V3
  Top 0.406: R9.2 JP1.8
  Bottom 0.406: IC4.3 12.89,69.62 arc90 C15.1 12.48,69.22 10.16,69.22 | 10.16,69.22 6.99,66.04 6.99,59.05 SV1.7 | JP1.8 10.16,69.22
ESP_GPIO0
  Top 0.406: JP1.3 5.08,56.52 8.89,60.33 10.79,60.33 SV1.6
ESP_GPIO2
  Top 0.406: JP1.2 4.76,53.98 8.57,57.78 12.7,57.78 13.65,58.74 13.65,60.64 12.7,61.59 SV1.4
ESP_PD  (via drill 0.6)
  Top 0.406: v23.18,60.33 23.18,59.37 36.83,45.72 41.27,45.72 45.09,41.91 48.9,41.91 50.8,40.01 v50.8,38.73 | JP1.4 6.99,61.59 SV1.3
  Bottom 0.254: v50.8,38.73 50.8,40.01 49.91,40.89 UC1.18
  Bottom 0.406: SV1.3 9.53,60.96 10.16,60.33 v23.18,60.33
ESP_RES  (via drill 0.6)
  Top 0.406: v7.94,65.41 6.67,66.67 JP1.7 8.57,66.67 9.53,67.63 9.53,68.48 R9.1
  Bottom 0.406: SV1.5 8.57,59.05 7.94,59.69 v7.94,65.41
ESP_RX  (via drill 0.6)
  Top 0.406: v46.99,38.73 46.35,39.37 45.09,39.37 41.27,43.18 36.83,43.18 26.67,53.34 15.24,53.34 SV1.8 12.7,56.52 14.29,58.1 14.29,61.28 12.7,62.87 5.71,62.87 JP1.5
  Bottom 0.254: v46.99,38.73 46.34,39.39 UC1.21
ESP_TX  (via drill 0.6)
  Top 0.406: v43.18,42.55 41.27,44.45 36.83,44.45 15.24,66.04 10.16,66.04 9.53,65.41 SV1.1 JP1.6
  Bottom 0.254: v43.18,42.55 43.18,39.37 43.66,38.89 UC1.22
GND  (via drill 0.6)
  Top 0.406: SV2.4 SV2.8 SV2.20 | C17.2 41.49,68.02 C18.- | C23.2 C24.2 19.55,35.91 X2.H2 14.88,35.91 14.61,36.2 | 14.61,36.2 13.97,35.56 v9.53,35.56 3.37,35.56 X2.H3 | 14.61,36.2 14.61,41.91 | 14.61,41.91 15.66,42.97 X2.6_(VSS) | 14.61,41.91 12.18,44.34 X2.H1 X2.A X2.H0 | R2.2 R4.2 17.14,13.55 R26.1 R24.1 | JP5.1 74.3,69.85 | 74.3,69.85 68.58,64.14 JP4.2 | 74.3,69.85 72.39,71.75 JP3.3 48.26,71.75 | IR1.GND 34.15,27.16 C20.-
  Top 1.016: IC5.2 76.58,27.3 78.11,27.3 79.52,28.72 C28.- | IC1.2 63.25,27.3 64.77,27.3 66.19,28.72 C12.- | JP2.3 42.69,76.34 C18.-
  Bottom 0.254: UC1.47 35.22,42.89 34.29,43.81 32.38,43.81 30.9,45.3 C8.2 | IR1.GND 36.83,32.38 37.31,32.86 | 37.31,32.86 38.39,33.95 UC1.35 | 43.5,38.42 43.52,38.39 UC1.23 | C1.2 46.35,52.05 46.35,51.44 43.81,48.9 41.91,48.9 40.96,47.94 40.96,47.31 41.39,46.88 UC1.8 41.39,43.06 41.91,42.55 41.91,40.01 43.5,38.42 | 37.31,32.96 37.31,32.86 | 43.5,38.42 45.72,38.42 46.04,38.1
  Bottom 0.406: R6.2 R7.2 C16.2 | C16.2 58.84,20.11 | 58.84,20.11 59.69,20.95 59.69,23.75 IC1.2 | C14.2 C11.2 52.28,19.68 | 52.28,19.68 52.28,20.32 | 52.28,20.32 C13.2 C10.2 | T2.2 9.85,35.24 v9.53,35.56 | C5.2 30.48,50.8 29.84,50.16 29.84,48.4 Q1.H 29.84,48.12 29.84,46.35 30.48,45.72 C8.2 | 58.84,20.11 C2.2 C29.2 | C15.2 15.04,67.73 C9.2 16.3,67.31 IC4.2 IC4.4 | R17.2 R18.2 C29.2 | C29.2 C26.2 | C29.2 72.81,20.11 73.66,20.95 73.66,24.38 IC5.2 | C16.2 52.5,20.11 arc-90 52.28,20.32 | IC2.2 46.99,22.23 47.62,21.59 47.62,19.9 arc90 C6.2 | IC3.2 46.99,17.14 47.62,17.78 | 47.62,17.78 47.62,19.47 arc-90 C6.2 | C6.2 52.28,19.68 | C7.2 47.62,14.82 47.62,17.78
  pour Top (isolate 0.305): 0,0 81.28,0 81.28,81.28 0,81.28
  pour Bottom (isolate 0.305, rank 2): 0,81.28 81.28,81.28 81.28,0 0,0
IR_RECV  (via drill 0.6)  (1 unrouted)
  Top 0.406: IR1.VO 41.91,32.38 41.91,41.27 41.27,41.91 34.29,41.91 v33.97,42.23
  Bottom 0.254: 39.37,41.91 39.35,41.89 | UC1.45 34.31,41.89 v33.97,42.23
LED  (via drill 0.6)
  Top 0.406: v48.9,40.01 R8.1
  Bottom 0.254: UC1.19 48.51,40.39 v48.9,40.01
LIGHT_AIN  (via drill 0.6)
  Top 0.406: R16.2 45.09,55.24 | PH1.2 45.09,55.24 | 45.09,55.24 48.9,51.44 v48.9,43.18
  Bottom 0.254: v48.9,43.18 48.6,42.89 UC1.14
LP2985_BYPASS
  Bottom 0.406: C11.1 50.59,18.09 IC3.4
LP2985_BYPASS1
  Bottom 0.406: C10.1 50.27,23.18 IC2.4
N$1
  Top 0.406: BUT.P$4 BUT.P$2 17.95,27.56 R3.2
N$2
  Top 0.406: R8.2 51.22,36.62 54.61,40.01 54.61,41.91 56.52,43.81 D1.A
N$3
  Top 0.406: JP2.2 R10.2
N$4
  Top 0.406: RESET.P$1 RESET.P$3 8.09,21.97 R2.1
N$5
  Bottom 0.406: IC5.4 69.47,15.28 R18.1 R17.1
N$6
  Top 0.406: SV2.19 R26.2
N$7  (via drill 0.6)
  Top 0.406: JP4.3 v62.23,66.67 | v59.69,69.22 JP3.2 52.7,69.22 50.8,67.31 SJ1.2
  Bottom 0.406: v59.69,69.22 v62.23,66.67
N$8
  Top 0.406: SV2.17 R24.2
N$9
  Top 0.406: SV2.11 R22.2
N$10
  Top 0.406: R15.1 C20.+ 38.24,28.72 IR1.VS
N$11  (via drill 0.6)
  Top 0.406: X2.1_(DAT2) v18.41,37.47
  Bottom 0.406: v18.41,37.47 17.14,37.47 14.54,40.08 RN1.8
N$14  (via drill 0.6)
  Top 0.406: X2.8_(DAT1) 16.48,45.09 v18.41,45.09
  Bottom 0.406: v18.41,45.09 17.14,45.09 14.54,42.48 RN1.5
N$56
  Bottom 0.406: IC1.4 56.13,15.28 R7.1 R6.1
OSC32_IN
  Bottom 0.254: UC1.3 38.89,47.47 38.55,47.81 Q1.2
  Bottom 0.406: C8.1 33.3,46.42 Q1.2
OSC32_OUT
  Bottom 0.254: UC1.4 39.39,46.34 39.37,48.26 38.92,48.71 38.28,48.71 Q1.1
  Bottom 0.406: Q1.1 33.3,50.09 C5.1
OSC_IN
  Bottom 0.254: OSC.3 40.64,50.73 40.64,48.9 39.89,48.15 UC1.5
  Bottom 0.406: OSC.3 37.4,52.07 C3.1
OSC_OUT
  Bottom 0.254: UC1.6 40.39,48.01 42.49,50.11 OSC.1
  Bottom 0.406: C1.1 43.28,50.28 OSC.1
PA5  (via drill 0.6)
  Top 0.406: JP5.11 v68.58,44.45
  Bottom 0.254: UC1.15 49.38,42.39 50.16,43.18 53.98,43.18 55.24,44.45 v68.58,44.45
PA8  (via drill 0.6)
  Top 0.406: JP5.10 69.22,46.99 v55.88,33.66
  Bottom 0.254: UC1.29 41.39,34.81 43.18,33.02 55.24,33.02 v55.88,33.66
PA9  (via drill 0.6)
  Top 0.406: JP5.9 70.48,49.53 53.34,32.38 v53.34,31.75
  Bottom 0.254: UC1.30 40.89,34.67 43.18,32.38 52.7,32.38 v53.34,31.75
PA10  (via drill 0.6)
  Top 0.406: JP5.8 71.75,52.07 51.44,31.75 v51.44,31.11
  Bottom 0.254: UC1.31 40.39,34.54 43.18,31.75 50.8,31.75 v51.44,31.11
PA11  (via drill 0.6)
  Top 0.406: JP5.7 73.03,54.61 49.53,31.11 v49.53,30.48
  Bottom 0.254: UC1.32 39.89,34.41 43.18,31.11 48.9,31.11 v49.53,30.48
PA12  (via drill 0.6)
  Top 0.406: JP5.6 74.3,57.15 46.99,29.84 v46.99,28.57
  Bottom 0.254: UC1.33 39.39,33 43.81,28.57 v46.99,28.57
PB2  (via drill 0.6)
  Top 0.406: JP5.5 75.56,59.69 v57.15,41.27
  Bottom 0.254: UC1.20 47.74,39.89 50.16,37.47 51.44,37.47 55.24,41.27 v57.15,41.27
PB9  (via drill 0.6)
  Top 0.406: v54.61,57.78 v57.78,57.78 | v69.85,60.33 71.75,62.23 JP5.4
  Bottom 0.254: UC1.46 35.08,42.39 34.29,43.18 29.21,43.18 27.3,45.09 27.3,52.7 34.29,59.69 52.7,59.69 v54.61,57.78
  Bottom 0.406: v57.78,57.78 58.42,57.78 60.96,60.33 v69.85,60.33
PB12  (via drill 0.6)
  Top 0.406: JP5.3 73.03,64.77 68.58,60.33 68.58,53.98 55.88,41.27 55.88,40.01 49.53,33.66 45.09,33.66 v44.45,34.29
  Bottom 0.254: UC1.25 43.39,35.35 v44.45,34.29
PC13  (via drill 0.6)
  Top 0.406: v37.47,46.99 41.27,46.99 42.55,45.72 v44.45,45.72 | v66.04,59.05 74.3,67.31 JP5.2
  Bottom 0.254: UC1.2 38.39,46.06 v37.47,46.99
  Bottom 0.406: v44.45,45.72 52.7,45.72 v66.04,59.05
RESET  (via drill 0.6)
  Top 0.406: R1.2 9.69,27.56 RESET.P$2 RESET.P$4 10.13,22.23 v12.7,22.23 | v40.64,40.96 40.64,36.2 36.2,31.75 22.86,31.75 21.59,30.48 SV2.15
  Bottom 0.254: v40.64,40.96 40.89,41.21 UC1.7
  Bottom 0.406: SV2.15 21.59,11.75 12.7,20.64 v12.7,22.23
SD_CS  (via drill 0.6)
  Top 0.406: X2.2_(CD/DAT3) v19.52,38.56 v29.68,38.56
  Bottom 0.254: UC1.41 31,39.89 v29.68,38.56
  Bottom 0.406: v19.52,38.56 17.32,38.56 15.01,40.88 RN1.7
SD_MISO  (via drill 0.6)
  Top 0.406: X2.7_(DAT0) v19.43,44.06 20.07,44.06 24.13,40.01 38.73,40.01 39.69,39.05 v39.69,38.1
  Bottom 0.254: v39.69,38.1 41.91,38.1 42.39,37.62 UC1.27
  Bottom 0.406: v19.43,44.06 17.39,44.06 15.01,41.67 RN1.6
SD_MOSI  (via drill 0.6)
  Top 0.406: X2.3_(CMD) v18.71,39.66 21.93,39.66 v22.23,39.37 | v43.18,34.29 43.18,33.66 46.35,30.48 46.35,29.21 45.09,27.94 43.81,27.94 40.01,31.75 37.47,31.75 36.83,31.11 27.3,31.11 v26.67,30.48
  Bottom 0.254: UC1.28 41.89,35.58 v43.18,34.29
  Bottom 0.406: R12.1 20.95,43.81 18.71,41.57 v18.71,39.66 | v26.67,30.48 24.13,30.48 23.5,31.11 23.5,38.1 v22.23,39.37
SD_PWR
  Bottom 0.254: UC1.43 25.79,40.89 24.77,41.91 21.59,41.91 20.95,41.27 20.95,35.56 17.14,31.75 12.55,31.75 T2.1
  Bottom 0.406: T2.1 10.02,34.29 8.89,34.29 8.26,34.92 8.26,36.2 8.89,36.83 R14.2
SD_PWR_INV
  Bottom 0.406: T3.1 14.12,33.34 T2.3 13.34,34.29 13.34,36.2 12.7,36.83 R14.1 11.85,37.03 R13.1
SD_SCK  (via drill 0.6)
  Top 0.406: X2.5_(CLK) 21,41.87 23.5,39.37 37.78,39.37 v38.42,38.42
  Bottom 0.254: v38.42,38.42 39.05,39.37 41.27,39.37 42.89,37.76 UC1.26
SD_SWITCH  (via drill 0.6)
  Top 0.406: X2.B v19.45,46.12 v24.54,41.02
  Bottom 0.254: UC1.42 25.17,40.39 v24.54,41.02
  Bottom 0.406: v19.45,46.12 16.27,46.12 15.88,45.72 R11.1
SDIO_VCC  (via drill 0.6)
  Top 0.406: C23.1 C24.1 19.47,34.29 v18.41,34.29 | X2.4_(VDD) v19.56,40.77
  Bottom 0.406: T3.3 v18.41,34.29 20.32,36.2 20.32,40.01 v19.56,40.77
TCK  (via drill 0.6)
  Top 0.406: v29.21,15.24 SV2.9
  Bottom 0.254: UC1.37 32.81,37.89 31.43,36.51 31.43,18.41 29.21,16.19 v29.21,15.24
  Bottom 0.406: R20.2 SV2.9
TDI  (via drill 0.6)
  Top 0.406: SV2.5 34.29,15.56 v30.16,19.68
  Bottom 0.254: v30.16,19.68 30.16,20.64 30.8,21.27 30.8,36.51 32.67,38.39 UC1.38
  Bottom 0.406: R23.2 SV2.5
TDO  (via drill 0.6)
  Top 0.406: SV2.13 v24.13,15.24
  Bottom 0.254: v24.13,15.24 30.16,21.27 30.16,36.51 32.54,38.89 UC1.39
  Bottom 0.406: SV2.13 R19.2
TMS  (via drill 0.6)
  Top 0.406: SV2.7 v31.75,15.24
  Bottom 0.254: UC1.34 38.89,33.81 38.1,33.02 38.1,27.3 34.92,24.13 34.92,19.05 31.75,15.88 v31.75,15.24
  Bottom 0.406: R21.2 SV2.7
TRST  (via drill 0.6)
  Top 0.406: SV2.3 36.83,17.14 v28.89,25.08
  Bottom 0.254: v28.89,25.08 28.89,26.04 29.53,26.67 29.53,36.51 32.41,39.39 UC1.40
  Bottom 0.406: R25.2 SV2.3
WS_DATA  (via drill 0.6)
  Top 0.406: R10.1 v40.64,70.48 | v45.72,70.48 45.72,60.33 50.8,55.24 v50.8,41.91
  Bottom 0.254: UC1.16 50.78,41.89 arc90 v50.8,41.91
  Bottom 0.406: v40.64,70.48 v45.72,70.48
WS_ENA  (via drill 0.6)
  Top 0.406: v53.34,40.64 v53.34,60.33
  Bottom 0.254: UC1.17 50.05,41.39 50.8,40.64 v53.34,40.64
  Bottom 0.406: v53.34,60.33 52.7,60.96 41.27,60.96 39.79,62.45 R5.1 32.38,66.04 31.11,67.31 T1.4
WS_SUPPLY
  Top 0.406: C17.1 39.79,68.02 C18.+
  Top 1.016: JP2.1 38.59,76.34 C18.+
  pour Bottom: 29.84,78.11 30.48,78.74 38.73,78.74 39.37,78.11 39.37,75.56 38.73,74.93 30.48,74.93 29.84,75.56

### Text on the board
tPlace: RGB Clock v0.1 / M.B. 11.2014 | https://github.com/matthiasb85/RGB-Clock